# EAGLE schematic Esquema_CURTIS (EAGLE 8.0.1)
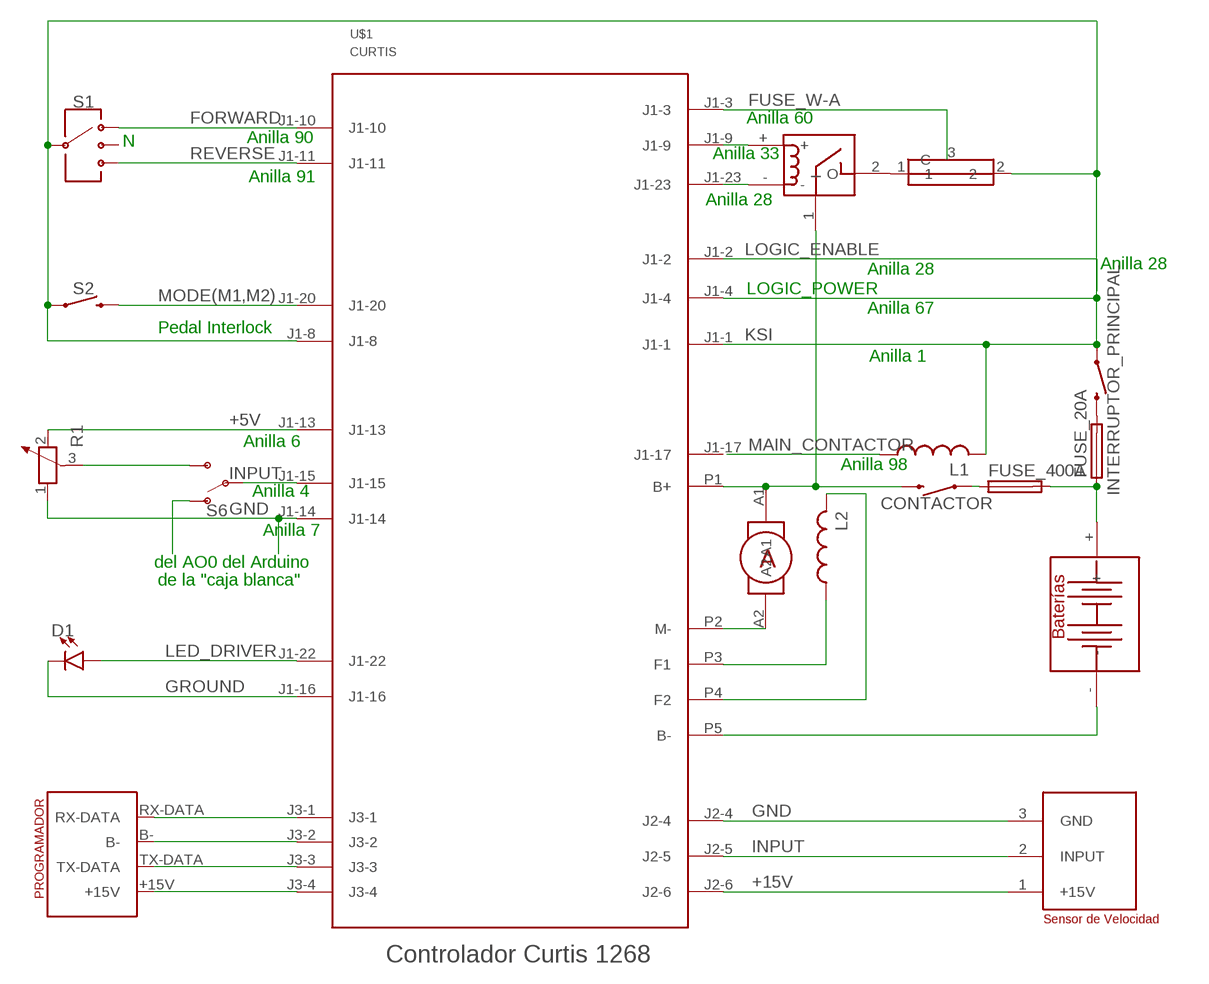
[diagram p0: schematic, sheet 1]

## Parts
CONTACTOR  MOMENTARY-SWITCH-SPST-PTH-6.0MM  [TACTILE_SWITCH_PTH_6.0MM]
D1  LED-3MM-NO_SILK  [LED_3MM-NS]
FUSE_20A  GSH15  [GSH15]
FUSE_400A  GSH15  [GSH15]
INTERRUPTOR_PRINCIPAL  MOMENTARY-SWITCH-SPST-PTH-6.0MM  [TACTILE_SWITCH_PTH_6.0MM]
L1  L-US0204/5  [0204/5]
L2  L-US0204/5  [0204/5]
R1  POTENTIOMETER_PT-10S  [PT-10S]
S1  SWITCH-SP3T-SMD  [SWITCH_SP3T_SMD]
S2  MOMENTARY-SWITCH-SPST-PTH-6.0MM  [TACTILE_SWITCH_PTH_6.0MM]
S6  SWITCH-SPDT-PTH-11.6X4.0MM  [SWITCH_SPDT_PTH_11.6X4.0MM]
U$1  CURTIS  [CURTIS]
U$2  MOTOR  [MOTOR]
U$3  PROGRAMADOR  [PROGRAMADOR]
U$4  SENSOR_VELOCIDAD  [SENSOR_VEL]
U$5  BATERIA  [BATERIA]
U$6  RELE  [RELE]
U$7  FUSIBLE_R  [FUSIBLE_R]

## Nets
+5V: R1.2 U$1.J1-13
+15V: U$4.1(+15V)
FORWARD: S1.1 U$1.J1-10
FUSE_W-A: U$1.J1-3 U$7.3(C)
GND: R1.1 U$1.J1-14 U$4.3(GND)
GROUND: D1.K(C) U$1.J1-16
INPUT: S6.2(P) U$1.J1-15 U$4.2(INPUT)
KSI: INTERRUPTOR_PRINCIPAL.1 L1.2 S1.3 S2.1 U$1.J1-1 U$1.J1-4 U$1.J1-8 U$7.2
LED_DRIVER: D1.A U$1.J1-22
LOGIC_ENABLE: U$1.J1-2
MAIN_CONTACTOR: L1.1
MODE(M1,M2): S2.3 U$1.J1-20
N$1: CONTACTOR.3 U$1.P1(B+) U$2.A1 U$6.1(I)
N$2: U$6.2(O) U$7.1
N$3: CONTACTOR.1 FUSE_400A.1
N$4: L2.1
N$5: FUSE_20A.2 INTERRUPTOR_PRINCIPAL.3
N$6: R1.3 S6.3(S)
N$7: U$1.P5(B-) U$5.-
N$8: L2.2
N$9: U$1.J3-1 U$3.RX-DATA
N$10: U$1.J3-2 U$3.B-
N$11: U$1.J1-9 U$6.+
N$12: U$1.J3-3 U$3.TX-DATA
N$13: U$1.J1-23 U$6.-
N$15: U$1.J3-4 U$3.+15V
N$16: FUSE_20A.1 FUSE_400A.2 U$5.+
N$17: U$2.A2
N$20: S6.1(O)
REVERSE: S1.4 U$1.J1-11
Unconnected: S1.2 U$1.J1-17 U$1.J2-4 U$1.J2-5 U$1.J2-6 U$1.P2(M-) U$1.P3(F1) U$1.P4(F2)

## Notes on the sheet
- Anilla 60
- N | Anilla 90
- Anilla 33
- Anilla 91
- Anilla 28
- Anilla 28
- Anilla 28
- LOGIC_POWER
- Anilla 67
- Pedal Interlock
- Anilla 1
- Anilla 6
- Anilla 98
- Anilla 4
- Anilla 7
- del AO0 del Arduino
- de la "caja blanca"

## Library data of the parts
CONTACTOR INTERRUPTOR_PRINCIPAL S2 = SparkFun-Switches:MOMENTARY-SWITCH-SPST: Momentary Switch (Pushbutton) - SPST Normally-open (NO) SPST momentary switches (buttons, pushbuttons). Variants PTH-12MM - 12mm square, through-hole Momentary Pushbutton Switch - 12mm Square <https://www.sparkfun.com/products/9190> (COM-09190) PTH-6.0MM, PTH-6.0MM-KIT - 6.0mm square, through-hole Mini Pushbutton Switch <https://www.sparkfun.com/products/97> (COM-00097) KIT package intended for soldering kit's - only one side of pads' copper is exposed. PTH-RIGHT-ANGLE-KIT - Right-angle, through-hole Right Angle Tactile Button <https://www.sparkfun.com/products/10791> - Used on SparkFun BigTime Watch Kit <https://www.sparkfun.com/products/11734> SMD-12MM - 12mm square, surface-mount Tactile Button - SMD (12mm) <https://www.sparkfun.com/products/12993> (COM-12993) Used on SparkFun PicoBoard <https://www.sparkfun.com/products/11888> SMD-4.5MM - 4.5mm Square Trackball Switch Used on SparkFun Blackberry Trackballer Breakout <https://www.sparkfun.com/products/13169> SMD-4.6MMX2.8MM - 4.60mm x 2.80mm, surface mount Used on SparkFun SAMD21 Mini Breakout <https://www.sparkfun.com/products/13664> SMD-5.2MM, SMD-5.2-REDUNDANT - 5.2mm square, surface-mount Mini Pushbutton Switch - SMD <https://www.sparkfun.com/products/8720> (COM-08720) Used on Arduino Pro Mini <https://www.sparkfun.com/products/11114> REDUNDANT package connects both switch circuits together SMD-6.0X3.5MM - 6.0 x 3.5mm, surface mount Momentary Reset Switch SMD <https://www.sparkfun.com/products/8229> (COM-08229) SMD-6.2MM-TALL - 6.2mm square, surface mount Tactile Button - SMD (6mm) <https://www.sparkfun.com/products/12992> Used on SparkFun Digital Sandbox <https://www.sparkfun.com/products/12651> SMD-RIGHT-ANGLE - Right-angle, surface mount Used on SparkFun Block for Intel® Edison - Arduino <https://www.sparkfun.com/products/13036>; PROD_ID: SWCH-08441; SF_SKU: COM-00097
D1 = SparkFun-LED:LED: LED (Generic) Standard schematic elements and footprints for 5mm, 3mm, 1206, and 0603 sized LEDs. Generic LEDs with no color specified.
FUSE_20A FUSE_400A = fuse:GSH15: FUSE HOLDER grid 15mm, 19649 Wickmann; MPN: 64900001039; OC_FARNELL: 1271673; OC_NEWARK: 02P0318
L1 L2 = rcl:L-US: INDUCTOR, American symbol
R1 = rcl:POTENTIOMETER_: Potentiometer
S1 = SparkFun-Switches:SWITCH-SP3T: Single-Pole, Triple-Throw (SP3T) Switch Single-Pole, Triple-Throw switches SparkFun Products Prototype Part; PROD_ID: SWCH-10805
S6 = SparkFun-Switches:SWITCH-SPDT: Single Pole, Double Throw (SPDT) Switch Single-pole, double-throw (SPDT) switch. Variant Overview SMD-AYZ0202 Surface Mount DPDT Switch <https://www.sparkfun.com/products/597> (COM-00597) Used on e.g. LilyPad Arduino USB - ATmega32U4 Board <https://www.sparkfun.com/products/12049> PTH-11.6X4.0MM SPDT Mini Power Switch <https://www.sparkfun.com/products/102> (COM-00102) Used on e.g. SparkFun Simon Says - Through-Hole Soldering Kit <https://www.sparkfun.com/products/10547> (KIT-10547) PTH-11.6X4.0MM-KIT KIT version of SPDT Mini Power Switch - Simplifies soldering by removing tStop of switch pins - only one side can be soldered. PTH-11.6X4.0MM-LOCK LOCK version of SPDT Mini Power Switch - Offset pins hold switch in place for easier soldering. SMD-RIGHT-ANGLE Surface Mount Right Angle Switch <https://www.sparkfun.com/products/10860> (COM-10860) Used on e.g. SparkFun ESP8266 Thing <https://www.sparkfun.com/products/13231>; PROD_ID: SWCH-08261; SF_SKU: COM-00102
U$1 = ecar:CURTIS
U$2 = ecar:MOTOR
U$3 = ecar:PROGRAMADOR
U$4 = ecar:SENSOR_VELOCIDAD
U$5 = ecar:BATERIA
U$6 = ecar:RELE
U$7 = ecar:FUSIBLE_R